# Altium schematic sheet Pedalbox.SchDoc
size A
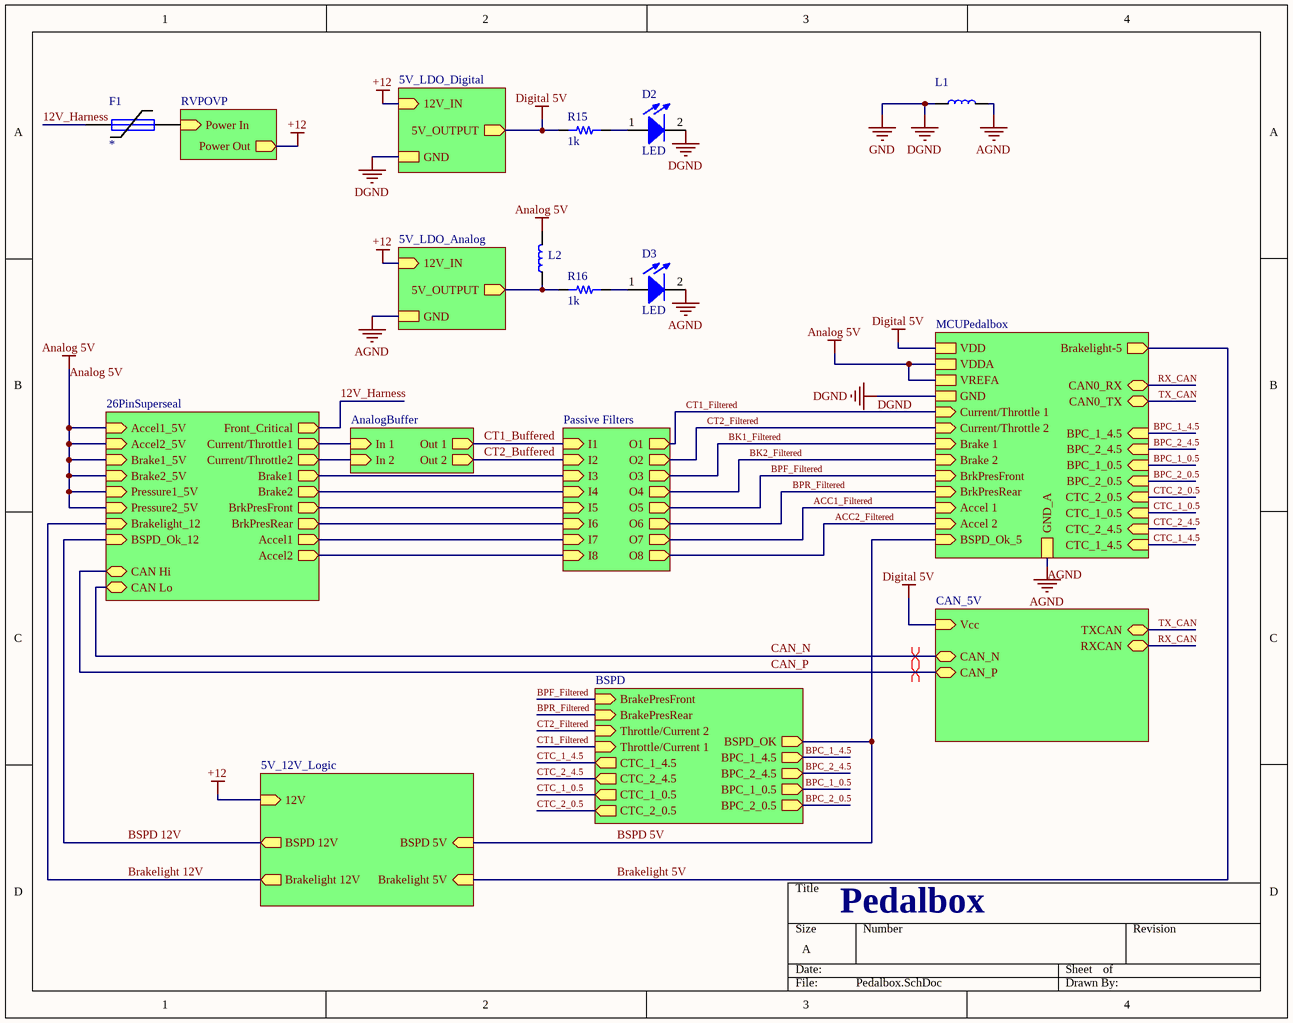
[diagram p0: Pedalbox.SchDoc]

## Parts
D2  LED  [0805_LED]
D3  LED  [0805_LED]
F1  (no value)  [PTC Fuse 2920/07351]
L1  MPZ1608S221ATA00  [0603]  (value not drawn)
L2  MPZ1608S221ATA00  [0603]  (value not drawn)
R15  resistance: 1k  [RES 0603/1608]  (hidden comment: resistor)
R16  resistance: 1k  [RES 0603/1608]  (hidden comment: resistor)

## Sub-sheets
5V_12V_Logic = 5V_12V_Logic.SchDoc: BSPD 5V (in), BSPD 12V (out), Brakelight 5V (in), Brakelight 12V (out), 12V (in)
5V_LDO_Analog = 12V_to_5V_LDO_1A.SchDoc: 12V_IN (in), 5V_OUTPUT (out), GND
5V_LDO_Digital = 12V_to_5V_LDO_1A.SchDoc: 12V_IN (in), 5V_OUTPUT (out), GND
26PinSuperseal = 26PinSuperseal.SchDoc: Front_Critical (out), Accel1_5V (in), Accel2_5V (in), Brake1_5V (in), Brake1 (out), Brake2_5V (in), Brake2 (out), Pressure1_5V (in), Pressure2_5V (in), BSPD_Ok_12 (in), Brakelight_12 (in), CAN Hi (bidir), CAN Lo (bidir), Accel2 (out), Accel1 (out), Current/Throttle2 (out), Current/Throttle1 (out), BrkPresRear (out), BrkPresFront (out)
AnalogBuffer = AnalogBuffer.SchDoc: In 1 (in), In 2 (in), Out 1 (out), Out 2 (out)
BSPD = BSPD.SchDoc: BSPD_OK (out), BPC_1_4.5 (out), BPC_2_4.5 (out), BPC_1_0.5 (out), BPC_2_0.5 (out), CTC_2_4.5 (out), CTC_2_0.5 (out), CTC_1_4.5 (out), CTC_1_0.5 (out), BrakePresFront (in), BrakePresRear (in), Throttle/Current 2 (in), Throttle/Current 1 (in)
CAN_5V = CAN_5V.SchDoc: TXCAN (bidir), RXCAN (bidir), CAN_N (bidir), CAN_P (bidir), Vcc (in)
MCUPedalbox = MCUPedalbox.SchDoc: CAN0_RX (bidir), CAN0_TX (bidir), BSPD_Ok_5 (in), Brakelight-5 (out), BPC_1_4.5 (in), BPC_2_4.5 (in), BPC_2_0.5 (in), BPC_1_0.5 (in), CTC_1_0.5 (in), CTC_1_4.5 (in), CTC_2_0.5 (in), CTC_2_4.5 (in), Current/Throttle 1 (in), Accel 1 (in), Accel 2 (in), Current/Throttle 2 (in), Brake 2 (in), BrkPresFront (in), BrkPresRear (in), Brake 1 (in), GND_A, VDD, GND, VDDA, VREFA
Passive Filters = Passive Filters.SchDoc: I1 (in), O1 (out), I2 (in), O2 (out), I3 (in), O3 (out), I4 (in), O4 (out), I5 (in), O5 (out), I6 (in), O6 (out), I7 (in), O7 (out), I8 (in), O8 (out)
RVPOVP = RVPOVP.SchDoc: Power In (in), Power Out (out)

## Nets
+12: sheet 5V_12V_Logic/12V, sheet RVPOVP/Power Out, sheet 5V_LDO_Digital/12V_IN, sheet 5V_LDO_Analog/12V_IN
AGND: D3.2(K) L1.2 ; sheet MCUPedalbox/GND_A, sheet 5V_LDO_Analog/GND
Analog 5V: L2.2 ; sheet 26PinSuperseal/Accel1_5V, sheet 26PinSuperseal/Accel2_5V, sheet 26PinSuperseal/Brake1_5V, sheet 26PinSuperseal/Brake2_5V, sheet 26PinSuperseal/Pressure1_5V, sheet 26PinSuperseal/Pressure2_5V, sheet MCUPedalbox/VDDA, sheet MCUPedalbox/VREFA
DGND: D2.2(K) L1.1 ; sheet MCUPedalbox/GND, sheet 5V_LDO_Digital/GND  [also labelled GND]
Digital 5V: R15.1 ; sheet MCUPedalbox/VDD, sheet CAN_5V/Vcc, sheet 5V_LDO_Digital/5V_OUTPUT
12V_Harness: F1.1 ; sheet 26PinSuperseal/Front_Critical
ACC1_Filtered: sheet Passive Filters/O7, sheet MCUPedalbox/Accel 1
ACC2_Filtered: sheet Passive Filters/O8, sheet MCUPedalbox/Accel 2
BK1_Filtered: sheet Passive Filters/O3, sheet MCUPedalbox/Brake 1
BK2_Filtered: sheet Passive Filters/O4, sheet MCUPedalbox/Brake 2
BPC_1_0.5: sheet BSPD/BPC_1_0.5, sheet MCUPedalbox/BPC_1_0.5
BPC_1_4.5: sheet BSPD/BPC_1_4.5, sheet MCUPedalbox/BPC_1_4.5
BPC_2_0.5: sheet BSPD/BPC_2_0.5, sheet MCUPedalbox/BPC_2_0.5
BPC_2_4.5: sheet BSPD/BPC_2_4.5, sheet MCUPedalbox/BPC_2_4.5
BPF_Filtered: sheet Passive Filters/O5, sheet BSPD/BrakePresFront, sheet MCUPedalbox/BrkPresFront
BPR_Filtered: sheet Passive Filters/O6, sheet BSPD/BrakePresRear, sheet MCUPedalbox/BrkPresRear
Brakelight 5V: sheet 5V_12V_Logic/Brakelight 5V, sheet MCUPedalbox/Brakelight-5
Brakelight 12V: sheet 26PinSuperseal/Brakelight_12, sheet 5V_12V_Logic/Brakelight 12V
BSPD 5V: sheet BSPD/BSPD_OK, sheet 5V_12V_Logic/BSPD 5V, sheet MCUPedalbox/BSPD_Ok_5
BSPD 12V: sheet 26PinSuperseal/BSPD_Ok_12, sheet 5V_12V_Logic/BSPD 12V
CAN_N: sheet 26PinSuperseal/CAN Lo, sheet CAN_5V/CAN_N
CAN_P: sheet 26PinSuperseal/CAN Hi, sheet CAN_5V/CAN_P
CT1_Buffered: sheet Passive Filters/I1, sheet AnalogBuffer/Out 1
CT1_Filtered: sheet Passive Filters/O1, sheet BSPD/Throttle/Current 1, sheet MCUPedalbox/Current/Throttle 1
CT2_Buffered: sheet Passive Filters/I2, sheet AnalogBuffer/Out 2
CT2_Filtered: sheet Passive Filters/O2, sheet BSPD/Throttle/Current 2, sheet MCUPedalbox/Current/Throttle 2
CTC_1_0.5: sheet BSPD/CTC_1_0.5, sheet MCUPedalbox/CTC_1_0.5
CTC_1_4.5: sheet BSPD/CTC_1_4.5, sheet MCUPedalbox/CTC_1_4.5
CTC_2_0.5: sheet BSPD/CTC_2_0.5, sheet MCUPedalbox/CTC_2_0.5
CTC_2_4.5: sheet BSPD/CTC_2_4.5, sheet MCUPedalbox/CTC_2_4.5
RX_CAN: sheet MCUPedalbox/CAN0_RX, sheet CAN_5V/RXCAN
TX_CAN: sheet MCUPedalbox/CAN0_TX, sheet CAN_5V/TXCAN
NetD2_1: D2.1(A) R15.2
NetD3_1: D3.1(A) R16.2
NetF1_2: F1.2 ; sheet RVPOVP/Power In
NetL2_1: L2.1 R16.1 ; sheet 5V_LDO_Analog/5V_OUTPUT
(unnamed): sheet Passive Filters/I3, sheet 26PinSuperseal/Brake1
(unnamed): sheet Passive Filters/I4, sheet 26PinSuperseal/Brake2
(unnamed): sheet Passive Filters/I5, sheet 26PinSuperseal/BrkPresFront
(unnamed): sheet Passive Filters/I6, sheet 26PinSuperseal/BrkPresRear
(unnamed): sheet Passive Filters/I7, sheet 26PinSuperseal/Accel1
(unnamed): sheet Passive Filters/I8, sheet 26PinSuperseal/Accel2
(unnamed): sheet 26PinSuperseal/Current/Throttle2, sheet AnalogBuffer/In 2
(unnamed): sheet 26PinSuperseal/Current/Throttle1, sheet AnalogBuffer/In 1

## Layout directives
differential pair: CAN_N, CAN_P

## Notes on the sheet
- Pedalbox

## Library data of the parts
D2 D3 = 19: Generic 0805 LED; id: 19; vr: 1; name: 0805 LED; numcircuits: 1; package: 0805; quantity: 0
F1 = 11: Polymeric PTC Resettable Fuse 24V 2A Ih Surfa; id: 11; Name: 0ZCF0200AF2C; itrip: 4; iinterrupt: 0; vmax: 24; Published: 8-Jun-2000; LatestRevisionDate: 17-Jul-2002; LatestRevisionNote: Re-released for DXP Platform.; PackageReference: PIN-W2/E2.8; Publisher: Altium Limited; PackageDescription: Thru-Hole; 2 Leads; I_hold: *; quantity: 0; link: https://www.digikey.com/product-detail/en/bel-fuse-inc/0ZCF0200AF2C/507-1749-1-ND/4156183; createdby: Kevin
L1 L2 = 10: 220 Ohms @ 100MHz 1 Power Line Ferrite Bead 0; MF: TDK; id: 10; imax: 2.20000004768372; tolerance: 0; resistance: 50mOhm; MP: MPZ1608S221ATA00; SnapEDA_Link: https://www.snapeda.com/parts/MPZ1608S221ATA00/TDK-Lambda%20Americas%20Inc/view-part/?ref=snap; Digi-Key_Part_Number: 445-1565-1-ND; Digi-Key_Purchase_URL: https://www.digikey.com/product-detail/en/tdk-corporation/MPZ1608S221ATA00/445-1565-1-ND/571895?utm_source=snapeda&utm_medium=aggregator&utm_campaign=symbol; Package: 0603; Value: *; name: MPZ1608S221ATA00; quantity: 0; link: https://www.digikey.com/product-detail/en/tdk-corporation/MPZ1608S221ATA00/445-1565-1-ND/571895; createdby: Kevin
R15 R16 = 1: id: 1; name: 0603 Resistor; percent tolerance: 5; package: 0603; quantity: 0